# Altium schematic sheet XT long bus (13.3 X 4.2 inches).schdoc: XT long bus (13.3 X 4.2 inches)
size A; Organization: Organization; Address1: Address1; Address2: Address2; Address3: Address3; Address4: Address4; DocumentNumber: 1; Revision: 0; SheetNumber: 2; SheetTotal: 2
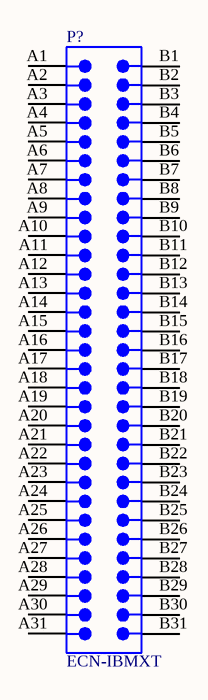
[diagram p0: XT long bus (13.3 X 4.2 inches).schdoc]

## Parts
P?  ECN-IBMXT  [ECN-IBMXT]

## Nets

Not connected (* = marked no-connect by the designer): P? A1 A2 A3 A4 A5 A6 A7 A8 A9 A10 A11 A12 A13 A14 A15 A16 A17 A18 A19 A20 A21 A22 A23 A24 A25 A26 A27 A28 A29 A30 A31 B1 B2 B3 B4 B5 B6 B7 B8 B9 B10 B11 B12 B13 B14 B15 B16 B17 B18 B19 B20 B21 B22 B23 B24 B25 B26 B27 B28 B29 B30 B31

## Library data of the parts
P? = ECN-IBMXT: Card, 62-Position; Text Field6: Alternate Layout Available; Text Field7: Published 14-Feb-2002